# Altium schematic sheet Esquematico.SchDoc
size A4
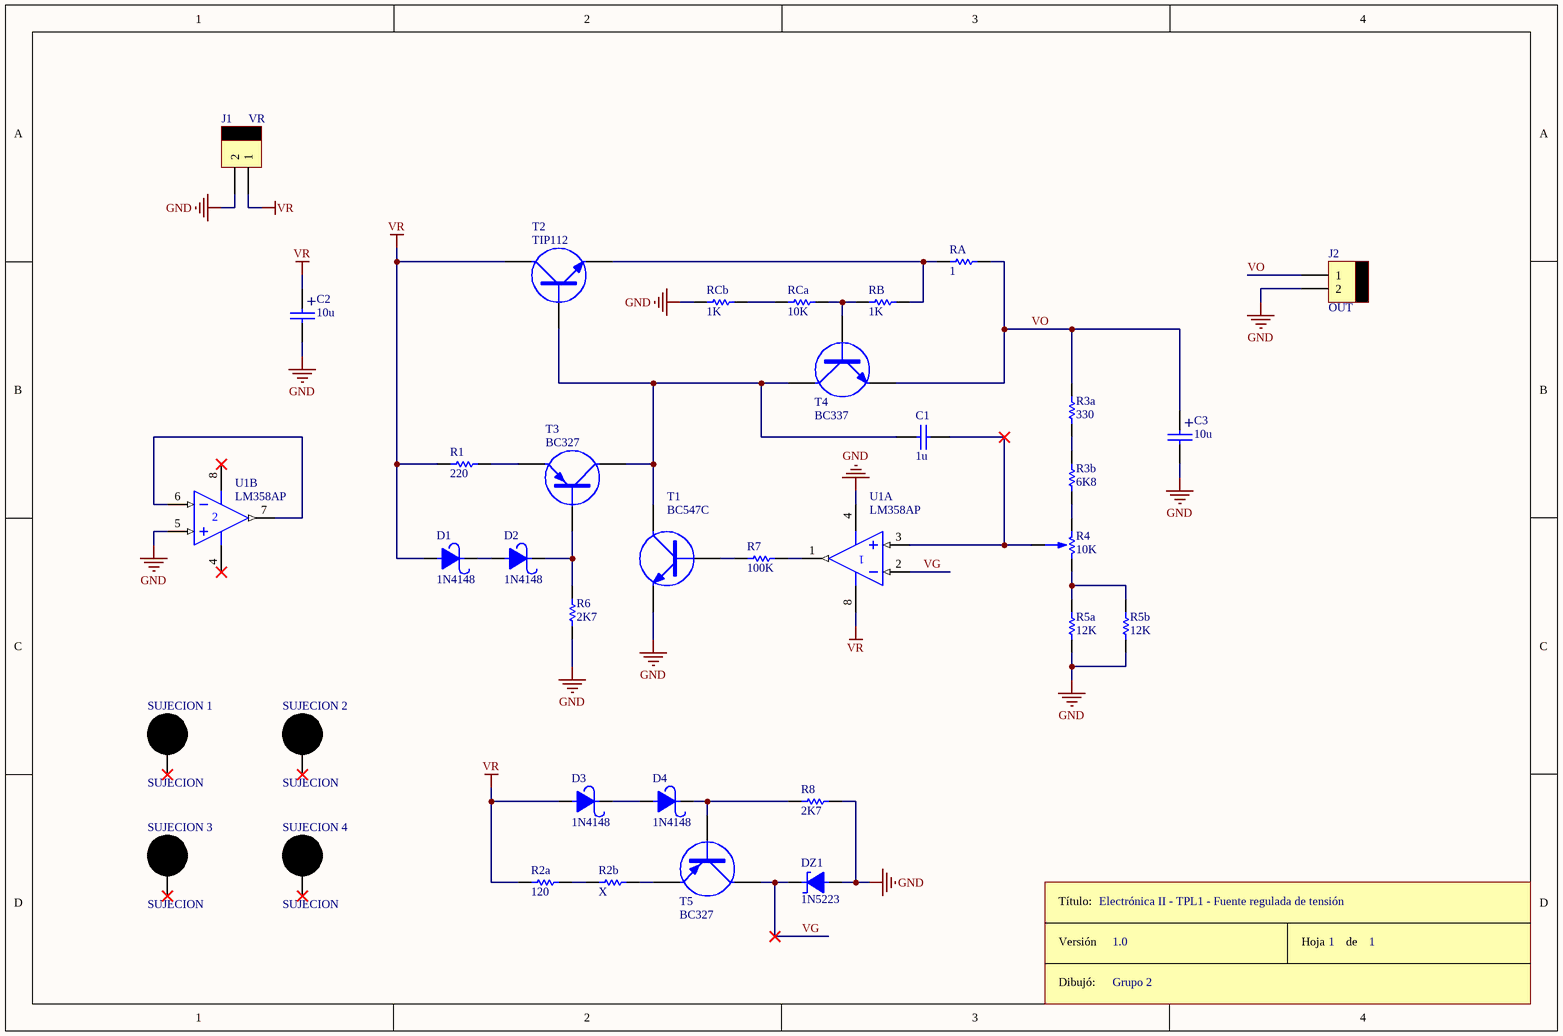
[diagram p0: Esquematico.SchDoc]

## Parts
C1  1u  [CAP200]
C2  10u  [CAP100RP]
C3  10u  [CAP100RP]
D1  1N4148  [DO41]
D2  1N4148  [DO41]
D3  1N4148  [DO41]
D4  1N4148  [DO41]
DZ1  1N5223  [DO41]
J1  VR  [MOLEX2]
J2  OUT  [MOLEX2]
R1  220  [RES300]
R2a  120  [RES300]
R2b  X  [RES300]
R3a  330  [RES300]
R3b  6K8  [RES300]
R4  10K  [POTENCIOMETRO]
R5a  12K  [RES300]
R5b  12K  [RES300]
R6  2K7  [RES300]
R7  100K  [RES300]
R8  2K7  [RES300]
RA  1  [RES600]
RB  1K  [RES300]
RCa  10K  [RES300]
RCb  1K  [RES300]
ROT1  Rótulo  (value not drawn)
SUJECION_1  SUJECION  [SUJECION (5.00MM - 3.50MM)]
SUJECION_2  SUJECION  [SUJECION (5.00MM - 3.50MM)]
SUJECION_3  SUJECION  [SUJECION (5.00MM - 3.50MM)]
SUJECION_4  SUJECION  [SUJECION (5.00MM - 3.50MM)]
T1  BC547C  [TO92]
T2  TIP112  [TO-220 V]
T3  BC327  [TO92]
T4  BC337  [TO92]
T5  BC327  [TO92]
U1  LM358AP  [P008]  (parts A,B of 2)

## Nets
GND: C2.2 C3.2 DZ1.1 J1.2 J2.2 R5a.1 R5b.1 R6.1 R8.2 RCb.1 T1.3(E) U1.4(V-) U1.5(IN+)
VR: C2.1 D1.1 D3.1 J1.1 R1.1 R2a.2 T2.2(C) U1.8(V+)
VG: DZ1.2 T5.2(C) U1.2(IN-)
VO: C3.1 J2.1 R3a.2 RA.2 T4.3(E)
NetC1_1: C1.1 T1.2(C) T2.1(B) T3.2(C) T4.2(C)
NetC1_2: C1.2 R4.2 U1.3(IN+)
NetD1_2: D1.2 D2.1
NetD2_2: D2.2 R6.2 T3.1(B)
NetD3_2: D3.2 D4.1
NetD4_2: D4.2 R8.1 T5.1(B)
NetR1_2: R1.2 T3.3(E)
NetR2a_1: R2a.1 R2b.1
NetR2b_2: R2b.2 T5.3(E)
NetR3a_1: R3a.1 R3b.2
NetR3b_1: R3b.1 R4.1
NetR4_3: R4.3 R5a.2 R5b.2
NetR7_1: R7.1 T1.1(B)
NetR7_2: R7.2 U1.1(OUT)
NetRA_1: RA.1 RB.2 T2.3(E)
NetRB_1: RB.1 RCa.2 T4.1(B)
NetRCa_1: RCa.1 RCb.2
NetU1_6: U1.6(IN-) U1.7(OUT)

Not connected (* = marked no-connect by the designer): SUJECION_1 1*; SUJECION_2 1*; SUJECION_3 1*; SUJECION_4 1*

## Notes on the sheet
- Electrónica II - TPL1 - Fuente regulada de tensión
- 1.0
- Grupo 2
- 1
- (in symbol CAPPOL) +
- (in symbol Rótulo) Título:; Versión; Hoja       de; Dibujó:

## Library data of the parts
C1 = CAP
C2 C3 = CAPPOL
D1-D4 = DIODO SCHOTTKY
DZ1 = DIODO ZENER
J1 J2 = MOLEX2
R1 R2a R2b R3a R3b R5a R5b R6-R8 RA RB RCa RCb = RES
R4 = POTENCIOMETRO
T1 T2 T4 = TRANSISTOR NPN
T3 T5 = TRANSISTOR PNP
U1 = LM358AP: Dual Operational Amplifier; Published: 15-Apr-2002; LatestRevisionDate: 04-Mar-2005; LatestRevisionNote: Stylized 3D Model Added.; DatasheetVersion: Aug-1988; PackageVersion: Jun-1999; PackageReference: P008; Publisher: Altium Limited; PackageDescription: DIP; 8 Leads; Row Spacing 7.62 mm; Pitch 2.54 mm; Code_JEDEC: MO-001-AN; ComponentLink1Description: Manufacturer Link; ComponentLink1URL: http://www.ti.com/; ComponentLink2Description: Datasheet; ComponentLink2URL: http://www-s.ti.com/sc/ds/lm358.pdf